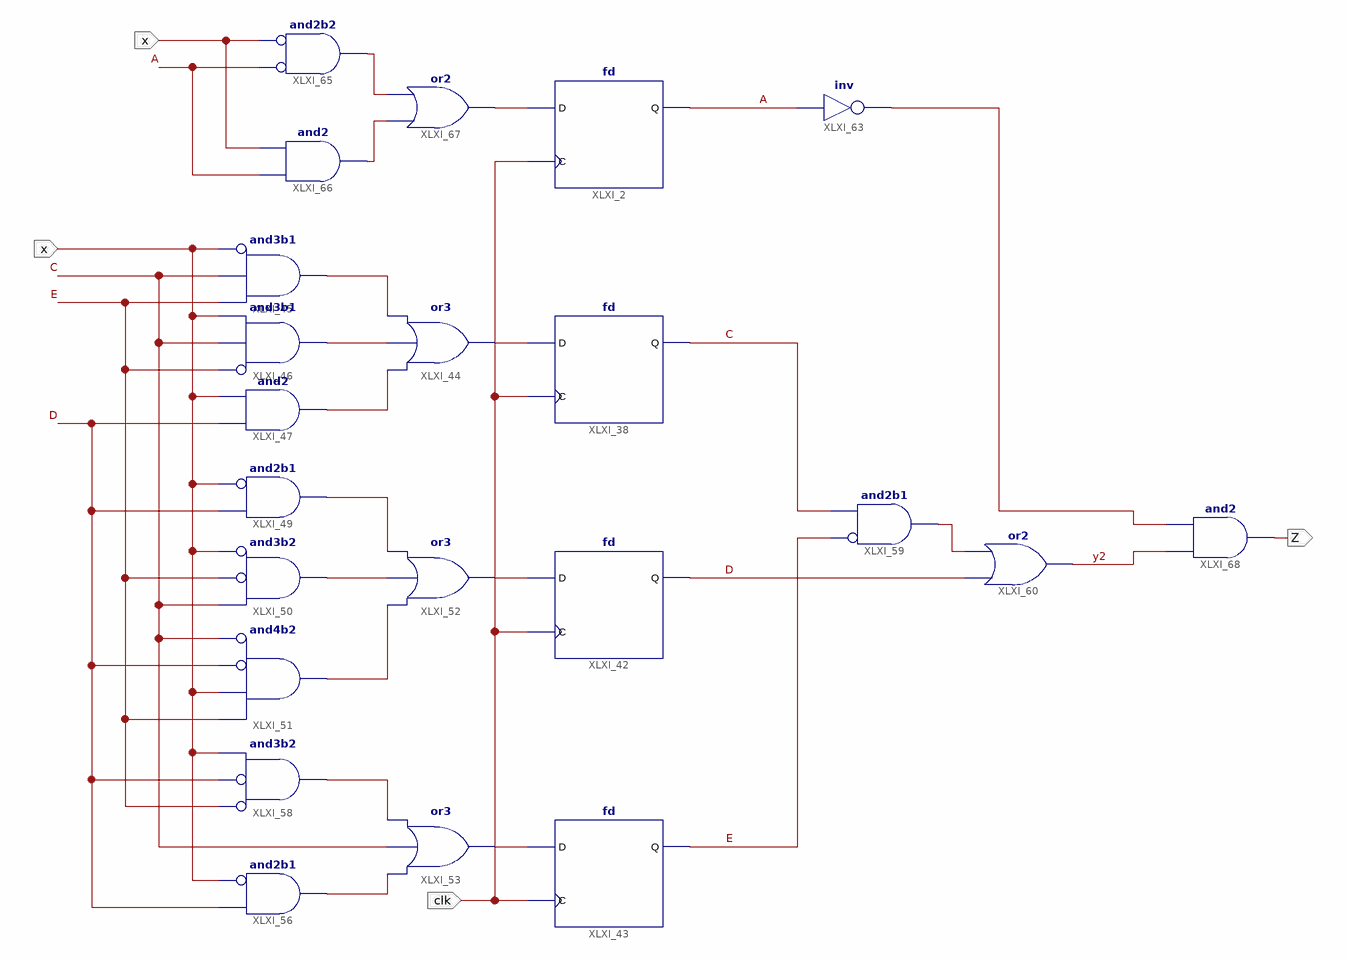
[diagram p0: schematic sheet 1]
// Xilinx ISE schematic project2_Moore.sch (xc9500) as structural Verilog: 22 symbols, 3 ports
module project2_Moore (
  input  x,
  input  clk,
  output Z
);

  wire A, C, D, E, XLXN_47, XLXN_48, XLXN_49, XLXN_50, XLXN_60, XLXN_61, XLXN_62, XLXN_63, XLXN_75, XLXN_76,
       XLXN_77, XLXN_80, XLXN_91, XLXN_92, XLXN_97, y1, y2;

  fd XLXI_38 (.C(clk), .D(XLXN_50), .Q(C));
  fd XLXI_42 (.C(clk), .D(XLXN_63), .Q(D));
  fd XLXI_43 (.C(clk), .D(XLXN_77), .Q(E));
  or XLXI_44 (XLXN_50, XLXN_49, XLXN_48, XLXN_47);
  and XLXI_45 (XLXN_47, ~x, C, E);  // and3b1
  and XLXI_46 (XLXN_48, ~E, C, x);  // and3b1
  and XLXI_47 (XLXN_49, D, x);
  and XLXI_49 (XLXN_60, ~x, D);  // and2b1
  and XLXI_50 (XLXN_61, ~x, ~E, C);  // and3b2
  and XLXI_51 (XLXN_62, ~C, ~D, x, E);  // and4b2
  or XLXI_52 (XLXN_63, XLXN_60, XLXN_61, XLXN_62);
  or XLXI_53 (XLXN_77, XLXN_75, C, XLXN_76);
  and XLXI_56 (XLXN_76, ~x, D);  // and2b1
  and XLXI_58 (XLXN_75, ~E, ~D, x);  // and3b2
  and XLXI_59 (XLXN_80, ~E, C);  // and2b1
  or XLXI_60 (y2, D, XLXN_80);
  not XLXI_63 (y1, A);
  fd XLXI_2 (.C(clk), .D(XLXN_97), .Q(A));
  and XLXI_65 (XLXN_92, ~A, ~x);  // and2b2
  and XLXI_66 (XLXN_91, A, x);
  or XLXI_67 (XLXN_97, XLXN_91, XLXN_92);
  and XLXI_68 (Z, y2, y1);
endmodule
